# Altium schematic sheet [2] BlockDiagram.SchDoc: =DocumentName
size A3; Organization: ORGANIZATION; Address1: R. Aprígio Veloso, 882, Universitário; Address2: Campina Grande - PB; Address3: 58429-900; DocumentNumber: 2; Revision: -; SheetNumber: 2; SheetTotal: 9; ENG_DATE: --/--/--; DSN_DATE: --/--/--; CHK_DATE: --/--/--; SCH_SCALE: 1:1
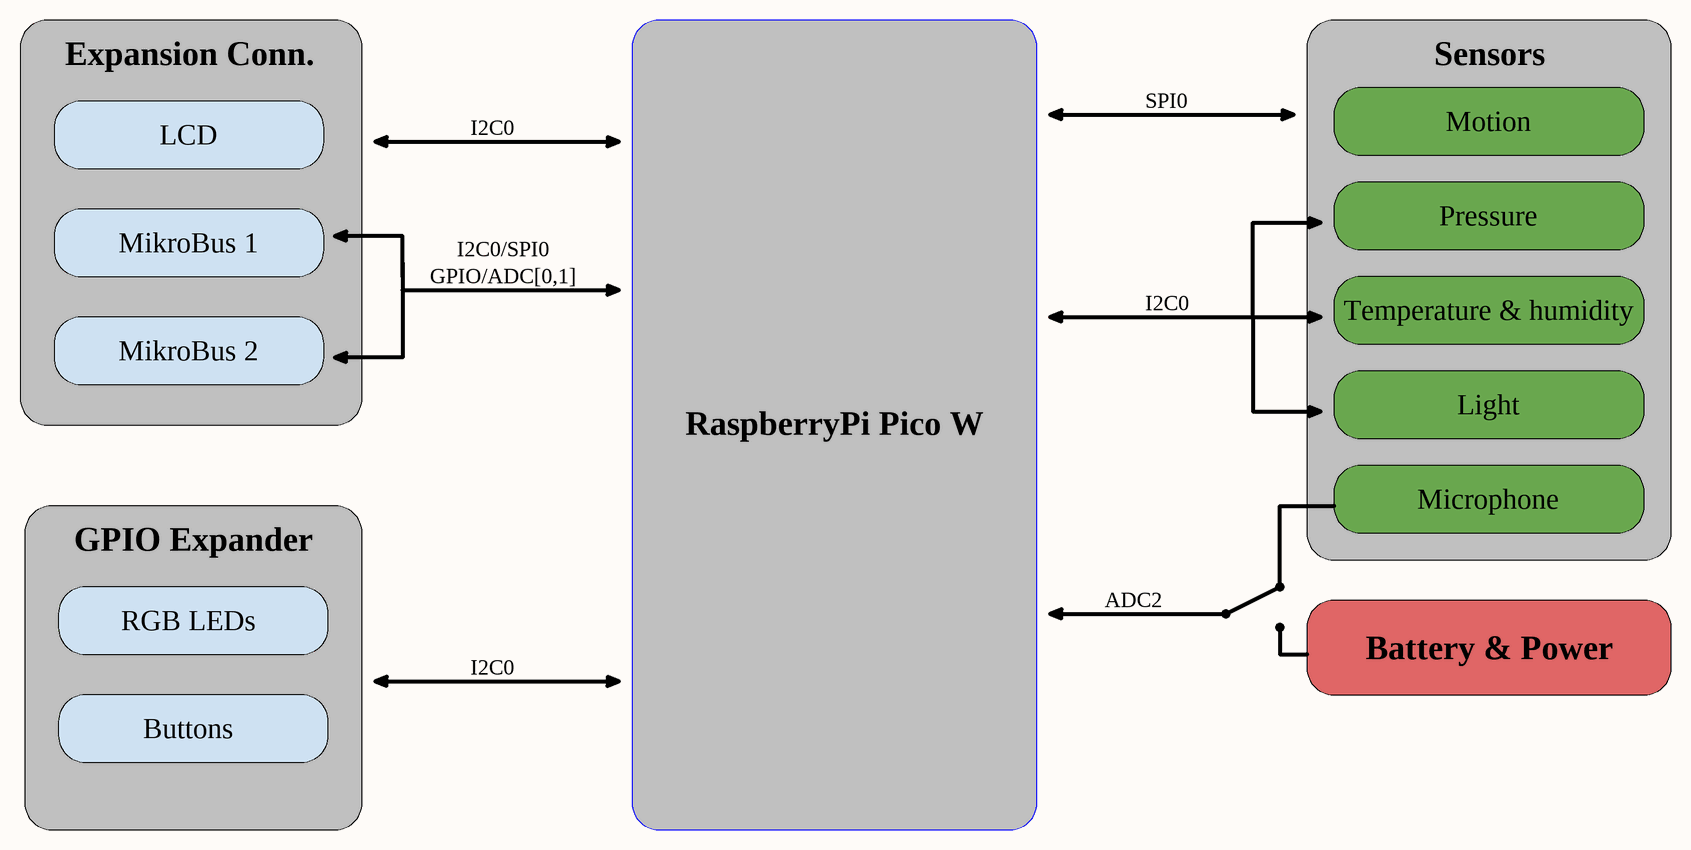
[diagram p0: [2] BlockDiagram.SchDoc]

## Notes on the sheet
- Expansion Conn.
- SPI0
- Sensors
- LCD
- I2C0
- Motion
- MikroBus 1
- Pressure
- GPIO/ADC[0,1]
- I2C0/SPI0
- Temperature & humidity
- MikroBus 2
- RaspberryPi Pico W
- Light
- Microphone
- GPIO Expander
- RGB LEDs
- ADC2
- Battery & Power
- Buttons
- REVISION
- DESCRIPTION
- DATE
- APPROVED
- ADDRESS
- PROJECT
- VERSION
- TITLE
- A3
- SIZE
- SCALE
- DOCUMENT NAME:
- DOCUMENT REVISION:
- OF
- SHEET:
- PROJECT REVISION: